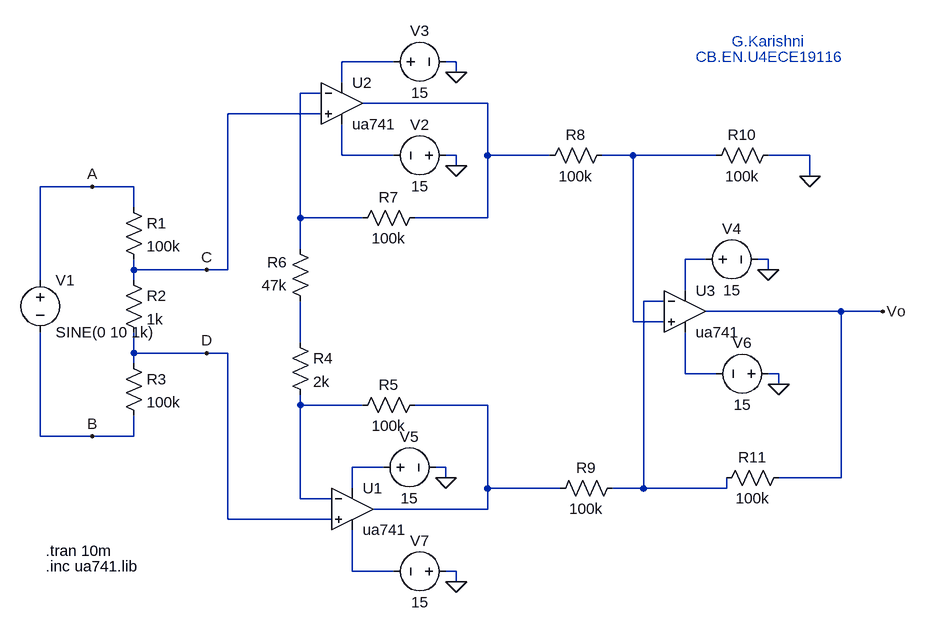
[diagram p0: schematic Draft1.asc]
Draft1.asc, the LTspice schematic file:
Version 4
SHEET 1 1376 680
WIRE 576 -208 496 -208
WIRE 672 -208 656 -208
WIRE 672 -192 672 -208
WIRE 496 -176 496 -208
WIRE 464 -160 432 -160
WIRE 720 -144 528 -144
WIRE 464 -128 320 -128
WIRE 496 -64 496 -112
WIRE 576 -64 496 -64
WIRE 672 -64 656 -64
WIRE 720 -64 720 -144
WIRE 816 -64 720 -64
WIRE 944 -64 896 -64
WIRE 1072 -64 944 -64
WIRE 1216 -64 1152 -64
WIRE 672 -48 672 -64
WIRE 1216 -32 1216 -64
WIRE 112 -16 32 -16
WIRE 176 -16 112 -16
WIRE 176 16 176 -16
WIRE 432 32 432 -160
WIRE 528 32 432 32
WIRE 720 32 720 -64
WIRE 720 32 608 32
WIRE 432 80 432 32
WIRE 1056 96 1024 96
WIRE 1152 96 1136 96
WIRE 176 112 176 96
WIRE 288 112 176 112
WIRE 320 112 320 -128
WIRE 320 112 288 112
WIRE 1152 112 1152 96
WIRE 32 128 32 -16
WIRE 176 128 176 112
WIRE 1024 144 1024 96
WIRE 992 160 960 160
WIRE 1264 176 1056 176
WIRE 1328 176 1264 176
WIRE 944 192 944 -64
WIRE 992 192 944 192
WIRE 432 224 432 160
WIRE 176 240 176 208
WIRE 288 240 176 240
WIRE 320 240 288 240
WIRE 176 256 176 240
WIRE 1024 272 1024 208
WIRE 1072 272 1024 272
WIRE 1168 272 1152 272
WIRE 1168 288 1168 272
WIRE 432 320 432 304
WIRE 528 320 432 320
WIRE 720 320 608 320
WIRE 32 368 32 208
WIRE 112 368 32 368
WIRE 176 368 176 336
WIRE 176 368 112 368
WIRE 560 416 512 416
WIRE 656 416 640 416
WIRE 656 432 656 416
WIRE 1264 432 1264 176
WIRE 1264 432 1168 432
WIRE 512 448 512 416
WIRE 720 448 720 320
WIRE 832 448 720 448
WIRE 960 448 960 160
WIRE 960 448 912 448
WIRE 1088 448 1088 432
WIRE 1088 448 960 448
WIRE 432 464 432 320
WIRE 480 464 432 464
WIRE 720 480 720 448
WIRE 720 480 544 480
WIRE 320 496 320 240
WIRE 480 496 320 496
WIRE 512 576 512 512
WIRE 576 576 512 576
WIRE 672 576 656 576
WIRE 672 592 672 576
FLAG 656 432 0
FLAG 672 592 0
FLAG 1168 288 0
FLAG 1152 112 0
FLAG 672 -192 0
FLAG 672 -48 0
FLAG 1216 -32 0
FLAG 112 -16 A
FLAG 112 368 B
FLAG 288 112 C
FLAG 288 240 D
FLAG 1328 176 Vo
SYMBOL voltage 32 112 R0
WINDOW 123 0 0 Left 0
WINDOW 39 0 0 Left 0
SYMATTR InstName V1
SYMATTR Value SINE(0 10 1k)
SYMBOL res 160 0 R0
SYMATTR InstName R1
SYMATTR Value 100k
SYMBOL res 160 112 R0
SYMATTR InstName R2
SYMATTR Value 1k
SYMBOL res 160 240 R0
SYMATTR InstName R3
SYMATTR Value 100k
SYMBOL res 416 208 R0
SYMATTR InstName R4
SYMATTR Value 2k
SYMBOL res 624 304 R90
WINDOW 0 0 56 VBottom 2
WINDOW 3 32 56 VTop 2
SYMATTR InstName R5
SYMATTR Value 100k
SYMBOL res 448 176 R180
WINDOW 0 36 76 Left 2
WINDOW 3 36 40 Left 2
SYMATTR InstName R6
SYMATTR Value 47k
SYMBOL res 512 48 R270
WINDOW 0 32 56 VTop 2
WINDOW 3 0 56 VBottom 2
SYMATTR InstName R7
SYMATTR Value 100k
SYMBOL res 800 -48 R270
WINDOW 0 32 56 VTop 2
WINDOW 3 0 56 VBottom 2
SYMATTR InstName R8
SYMATTR Value 100k
SYMBOL res 816 464 R270
WINDOW 0 32 56 VTop 2
WINDOW 3 0 56 VBottom 2
SYMATTR InstName R9
SYMATTR Value 100k
SYMBOL res 1056 -48 R270
WINDOW 0 32 56 VTop 2
WINDOW 3 0 56 VBottom 2
SYMATTR InstName R10
SYMATTR Value 100k
SYMBOL res 1072 448 R270
WINDOW 0 32 56 VTop 2
WINDOW 3 0 56 VBottom 2
SYMATTR InstName R11
SYMATTR Value 100k
SYMBOL OpAmps\\ua741 512 416 R0
SYMATTR InstName U1
SYMBOL OpAmps\\ua741 496 -208 R0
SYMATTR InstName U2
SYMBOL OpAmps\\ua741 1024 112 R0
SYMATTR InstName U3
SYMBOL voltage 672 -64 R90
WINDOW 0 -32 56 VBottom 2
WINDOW 3 32 56 VTop 2
WINDOW 123 0 0 Left 0
WINDOW 39 0 0 Left 0
SYMATTR InstName V2
SYMATTR Value 15
SYMBOL voltage 560 -208 R270
WINDOW 0 32 56 VTop 2
WINDOW 3 -32 56 VBottom 2
WINDOW 123 0 0 Left 0
WINDOW 39 0 0 Left 0
SYMATTR InstName V3
SYMATTR Value 15
SYMBOL voltage 1040 96 R270
WINDOW 0 32 56 VTop 2
WINDOW 3 -32 56 VBottom 2
WINDOW 123 0 0 Left 0
WINDOW 39 0 0 Left 0
SYMATTR InstName V4
SYMATTR Value 15
SYMBOL voltage 544 416 R270
WINDOW 0 32 56 VTop 2
WINDOW 3 -32 56 VBottom 2
WINDOW 123 0 0 Left 0
WINDOW 39 0 0 Left 0
SYMATTR InstName V5
SYMATTR Value 15
SYMBOL voltage 1168 272 R90
WINDOW 0 -32 56 VBottom 2
WINDOW 3 32 56 VTop 2
WINDOW 123 0 0 Left 0
WINDOW 39 0 0 Left 0
SYMATTR InstName V6
SYMATTR Value 15
SYMBOL voltage 672 576 R90
WINDOW 0 -32 56 VBottom 2
WINDOW 3 32 56 VTop 2
WINDOW 123 0 0 Left 0
WINDOW 39 0 0 Left 0
SYMATTR InstName V7
SYMATTR Value 15
TEXT 40 544 Left 2 !.tran 10m
TEXT 40 568 Left 2 !.inc ua741.lib
TEXT 1096 -240 Left 2 ;G.Karishni
TEXT 1040 -216 Left 2 ;CB.EN.U4ECE19116

The netlist it stands for:
* Draft1.asc
V1 A B SINE(0 10 1k)
R1 A C 100k
R2 C D 1k
R3 D B 100k
R4 N008 N010 2k
R5 N011 N010 100k
R6 N008 N002 47k
R7 N002 N003 100k
R8 N003 N005 100k
R9 N011 N007 100k
R10 N005 0 100k
R11 N007 Vo 100k
XU1 D N010 N012 N013 N011 ua741  ; pins In+ In- V+ V- OUT
XU2 C N002 N001 N004 N003 ua741  ; pins In+ In- V+ V- OUT
XU3 N005 N007 N006 N009 Vo ua741  ; pins In+ In- V+ V- OUT
V2 0 N004 15
V3 N001 0 15
V4 N006 0 15
V5 N012 0 15
V6 0 N009 15
V7 0 N013 15
.tran 10m
.inc ua741.lib
* G.Karishni
* CB.EN.U4ECE19116
.backanno
.end